# Altium project zx-ExternalROM.PrjPcb
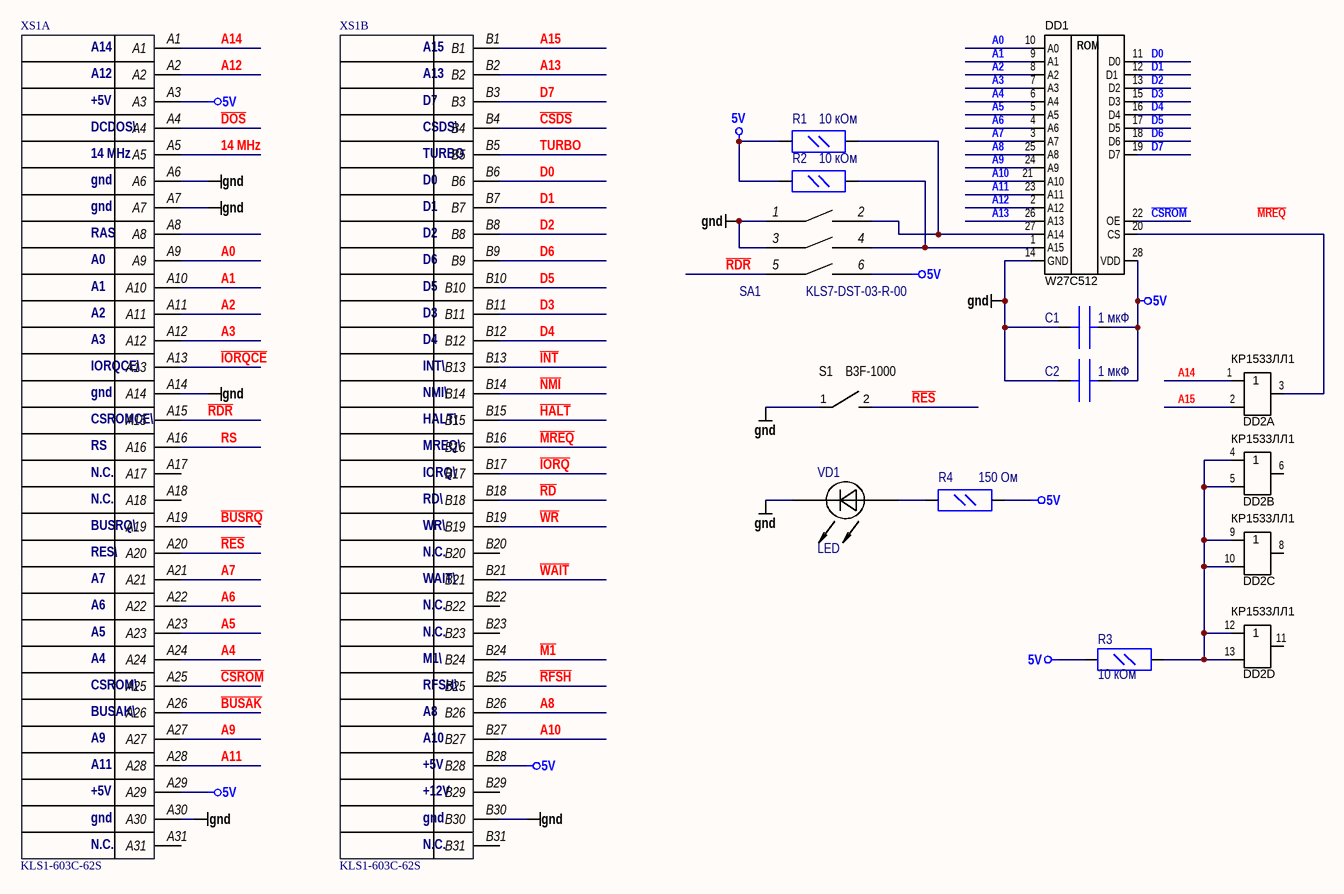
[diagram p0: zx-ExternalROM.SchDoc]
1 sheet, 12 parts. Net scope: global (net labels, ports and power ports of the same name join across sheets).
Board file: zx-ExternalROM.PcbDoc

## Sheet zx-ExternalROM.SchDoc
size 420 x 297 mm

### Parts
C1  1 мкФ  [CAP C 3216 (1206) 1.9h]
C2  1 мкФ  [CAP C 3216 (1206) 1.9h]
DD1  W27C512  [ZIF-28]
DD2  КР1533ЛЛ1  [DIP14]  (parts A,B,C,D of 4)
R1  10 кОм  [RES C 2012 (0805) 0.65h]
R2  10 кОм  [RES C 2012 (0805) 0.65h]
R3  10 кОм  [RES C 2012 (0805) 0.65h]
R4  150 Ом  [RES C 2012 (0805) 0.65h]
S1  B3F-1000  [SW_B3F-1000]
SA1  KLS7-DST-03-R-00  [KLS7-DST-03-R-00]
VD1  LED  [LED 3mm]
XS1  KLS1-603C-62S  [KLS1-603 ISA]  (parts A,B of 2)

### Nets
5V: C1.1 C2.1 DD1.28(VDD) R1.1 R2.1 R3.1 R4.2 SA1.6 XS1.A3 XS1.A29 XS1.B28
gnd: C1.2 C2.2 DD1.14(GND) S1.1 SA1.1 SA1.3 VD1.1 XS1.A6 XS1.A7 XS1.A14 XS1.A30 XS1.B30
14 MHz: XS1.A5
A0: DD1.10(A0) XS1.A9
A1: DD1.9(A1) XS1.A10
A2: DD1.8(A2) XS1.A11
A3: DD1.7(A3) XS1.A12
A4: DD1.6(A4) XS1.A24
A5: DD1.5(A5) XS1.A23
A6: DD1.4(A6) XS1.A22
A7: DD1.3(A7) XS1.A21
A8: DD1.25(A8) XS1.B26
A9: DD1.24(A9) XS1.A27
A10: DD1.21(A10) XS1.B27
A11: DD1.23(A11) XS1.A28
A12: DD1.2(A12) XS1.A2
A13: DD1.26(A13) XS1.B2
A14: DD2.1 XS1.A1
A15: DD2.2 XS1.B1
~{BUSAK}: XS1.A26
~{BUSRQ}: XS1.A19
~{CSDS}: XS1.B4
~{CSROM}: DD1.22(OE) XS1.A25
D0: DD1.11(D0) XS1.B6
D1: DD1.12(D1) XS1.B7
D2: DD1.13(D2) XS1.B8
D3: DD1.15(D3) XS1.B11
D4: DD1.16(D4) XS1.B12
D5: DD1.17(D5) XS1.B10
D6: DD1.18(D6) XS1.B9
D7: DD1.19(D7) XS1.B3
~{DOS}: XS1.A4
~{HALT}: XS1.B15
~{INT}: XS1.B13
~{IORQ}: XS1.B17
~{IORQCE}: XS1.A13
~{M1}: XS1.B24
~{MREQ}: XS1.B16
~{NMI}: XS1.B14
~{RD}: XS1.B18
~{RDR}: SA1.5 XS1.A15
~{RES}: S1.2 XS1.A20
~{RFSH}: XS1.B25
RS: XS1.A16
TURBO: XS1.B5
~{WAIT}: XS1.B21
~{WR}: XS1.B19
NetDD1_1: DD1.1(A15) R2.2 SA1.4
NetDD1_20: DD1.20(CS) DD2.3
NetDD1_27: DD1.27(A14) R1.2 SA1.2
NetDD2_4: DD2.4 DD2.5 DD2.9 DD2.10 DD2.12 DD2.13 R3.2
NetR4_1: R4.1 VD1.2

Not connected (* = marked no-connect by the designer): DD2 6 7(GND) 8 11 14(VCC); XS1 A8 A17 A18 A31 B20 B22 B23 B29 B31

### Notes on the sheet
- Labels drawn without touching a wire or pin: ~{MREQ}
- Подп. и дата
- Справ. №
- Инв.№ дубл
- Взам. инв№
- Подп и дата
- Изм
- Лист
- № докум.
- Подпись
- Дата
- Лит.
- Масса
- Масштаб
- Разраб.
- Проверил
- Т. контр.
- Схема электрическая принципиальная
- Листов
- Инв.№ подп.
- Н. контр.
- АО НПЦ "Горноспасательные
- технологии
- Утверждаю
- (in symbol KLS1-603C-64S, part A) +5V; DCDOS\; 14 MHz; gnd; RAS; A0; IORQCE\; CSROMCE\; RS; N.C.; BUSRQ\; RES\; CSROM\; BUSAK\
- (in symbol KLS1-603C-64S, part B) D7; CSDS\; TURBO; D0; D1; D2; D6; D5; D3; D4; INT\; NMI\; HALT\; MREQ\; IORQ\; RD\; WR\; N.C.; WAIT\; M1\; RFSH\; +5V; +12V; gnd
- (in symbol W27C512) ROM

### Library data of the parts
C1 C2 = ЧИП-1206-X5R-1 мкФ 50В ±10%: Конденсатор не полярный; Part Number: CC1206KKX5R9BB105; Manufacturer: Yageo; AltValue: 1; Nominal: 1000000; Voltage: 50; Tolerance: ±10%; Standard sizes of packages: 3216 (1206); Dielectric: X5R; Note: Конденсатор типоразмер 3216 (1206), general purpose; FullName: ЧИП-1206-X5R-1 мкФ 50В ±10%; Name: ЧИП-1206; Value: 1 мкФ; Units: мкФ
R1-R3 = ЧИП-0805-10 кОм ±5%: Резистор 0.125 Вт; Part Number: RC0805JR-0710KL; Manufacturer: Yageo; AltValue: 10; Nominal: 10000; Tolerance: ±5%; Power: 1/8W (0.125W); Standard sizes of packages: 2012 (0805); Note: Резистор постоянный, 0805; FullName: ЧИП-0805-10 кОм ±5%; Name: ЧИП-0805; Value: 10 кОм; Units: кОм
R4 = ЧИП-0805-150 Ом ±5%: Резистор 0.125 Вт; Part Number: RC0805JR-07150RL; Manufacturer: Yageo; AltValue: 150; Tolerance: ±5%; Power: 1/8W (0.125W); Standard sizes of packages: 2012 (0805); Note: Резистор постоянный, 0805; FullName: ЧИП-0805-150 Ом ±5%; Name: ЧИП-0805; Value: 150 Ом; Units: Ом; Nominal: 150
S1 = B3F-1000: pin to pad: 1>1+2 2>4+3; ChipDip PN: 8001787102; Platan PN: 2011347247
SA1 = KLS7-DST-03-R-00: Переключатель 3-х позиционный
XS1 = KLS1-603C-64S